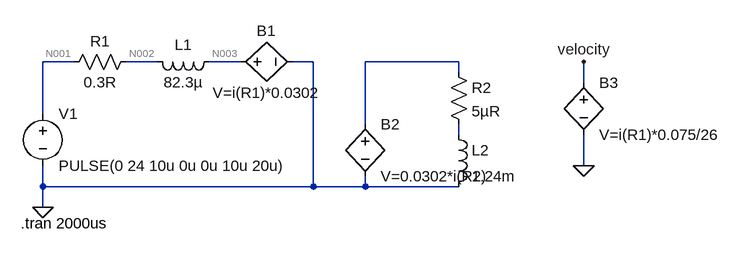
[diagram p0: schematic pmw_dcmotor.asc]
pmw_dcmotor.asc, the LTspice schematic file:
Version 4
SHEET 1 1124 680
WIRE 96 16 48 16
WIRE 224 16 176 16
WIRE 352 16 304 16
WIRE 464 16 432 16
WIRE 688 16 544 16
WIRE 688 32 688 16
WIRE 880 48 880 16
WIRE 48 96 48 16
WIRE 544 112 544 16
WIRE 688 128 688 112
WIRE 880 176 880 128
WIRE 48 208 48 176
WIRE 464 208 464 16
WIRE 464 208 48 208
WIRE 544 208 544 192
WIRE 544 208 464 208
WIRE 688 208 544 208
WIRE 48 240 48 208
FLAG 48 240 0
FLAG 880 16 velocity
FLAG 880 176 0
SYMBOL voltage 48 80 R0
WINDOW 123 0 0 Left 0
WINDOW 39 0 0 Left 0
SYMATTR InstName V1
SYMATTR Value PULSE(0 24 10u 0u 0u 10u 20u)
SYMBOL res 192 0 R90
WINDOW 0 0 56 VBottom 2
WINDOW 3 32 56 VTop 2
SYMATTR InstName R1
SYMATTR Value 0.3R
SYMBOL ind 320 0 R90
WINDOW 0 5 56 VBottom 2
WINDOW 3 32 56 VTop 2
SYMATTR InstName L1
SYMATTR Value 82.3µ
SYMBOL bv 336 16 R270
WINDOW 0 32 56 VTop 2
WINDOW 3 -32 56 VBottom 2
SYMATTR InstName B1
SYMATTR Value V=i(R1)*0.0302
SYMBOL bv 544 96 R0
SYMATTR InstName B2
SYMATTR Value V=0.0302*i(R2)
SYMBOL res 672 16 R0
SYMATTR InstName R2
SYMATTR Value 5µR
SYMBOL ind 672 112 R0
SYMATTR InstName L2
SYMATTR Value 1.24m
SYMBOL bv 880 32 R0
SYMATTR InstName B3
SYMATTR Value V=i(R1)*0.075/26
TEXT 14 264 Left 2 !.tran 2000us

The netlist it stands for:
* pmw_dcmotor.asc
V1 N001 0 PULSE(0 24 10u 0u 0u 10u 20u)
R1 N002 N001 0.3R
L1 N003 N002 82.3µ
B1 N003 0 V=i(R1)*0.0302
B2 N004 0 V=0.0302*i(R2)
R2 N004 N005 5µR
L2 N005 0 1.24m
B3 velocity 0 V=i(R1)*0.075/26
.tran 2000us
.backanno
.end

* Results of the author's LTspice run, read from the files saved beside the schematic
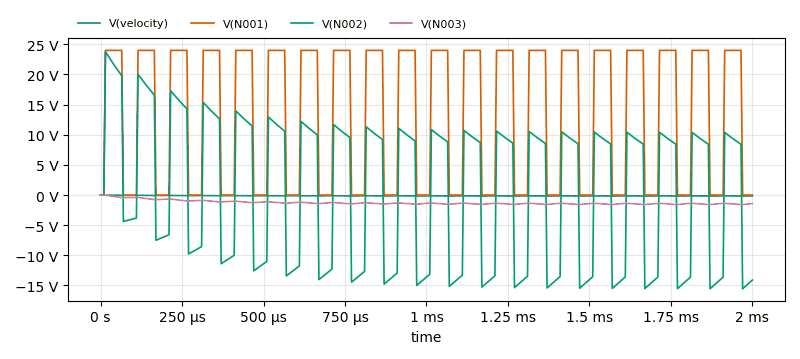
[diagram p1: Transient Analysis of pmw_dcmotor.asc, plotted from the saved traces]
* Transient Analysis, 1 run:
*   V(velocity): min -150.1 mV, max 0 V, average -120.1 mV, rms 124.4 mV, last -135.4 mV
*   V(N001): min 0 V, max 24 V, average 13.2 V, rms 17.58 V, last 0 V
*   V(N002): min -15.55 V, max 23.78 V, average 713.8 mV, rms 12.16 V, last -14.09 V
*   V(N003): min -1.571 V, max 0 V, average -1.257 V, rms 1.302 V, last -1.418 V